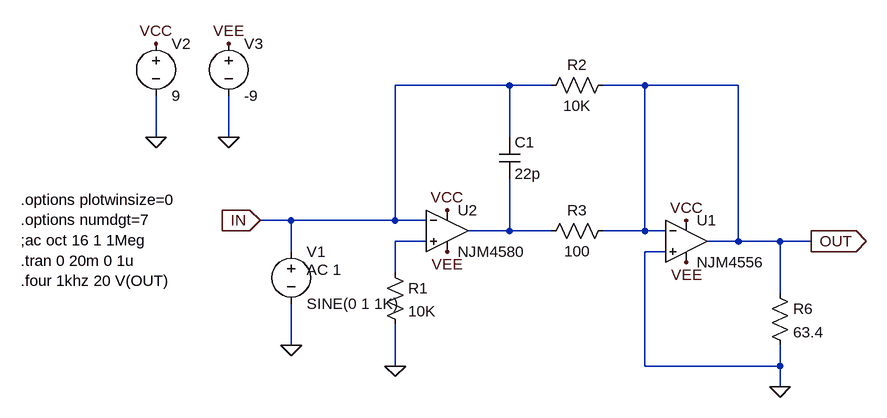
[diagram p0: schematic njm.inv.headphone.amplifier.asc]
njm.inv.headphone.amplifier.asc, the LTspice schematic file:
Version 4
SHEET 1 880 680
WIRE 128 -352 -48 -352
WIRE 192 -352 128 -352
WIRE 336 -352 272 -352
WIRE 480 -352 336 -352
WIRE -416 -272 -416 -336
WIRE -304 -272 -304 -336
WIRE 128 -272 128 -352
WIRE -208 -144 -256 -144
WIRE -48 -144 -48 -352
WIRE -48 -144 -208 -144
WIRE 0 -144 -48 -144
WIRE 128 -128 128 -208
WIRE 128 -128 64 -128
WIRE 192 -128 128 -128
WIRE 336 -128 336 -352
WIRE 336 -128 272 -128
WIRE 368 -128 336 -128
WIRE 0 -112 -48 -112
WIRE 480 -112 480 -352
WIRE 480 -112 432 -112
WIRE 544 -112 480 -112
WIRE 592 -112 544 -112
WIRE -208 -96 -208 -144
WIRE 368 -96 336 -96
WIRE -48 -64 -48 -112
WIRE 544 -32 544 -112
WIRE -208 48 -208 -16
WIRE -48 80 -48 16
WIRE 336 80 336 -96
WIRE 544 80 544 48
WIRE 544 80 336 80
WIRE 544 112 544 80
FLAG 592 -112 OUT
IOPIN 592 -112 Out
FLAG -48 80 0
FLAG 544 112 0
FLAG -208 48 0
FLAG 32 -160 VCC
FLAG 400 -144 VCC
FLAG 32 -96 VEE
FLAG 400 -80 VEE
FLAG -256 -144 IN
IOPIN -256 -144 In
FLAG -416 -416 VCC
FLAG -304 -416 VEE
FLAG -416 -272 0
FLAG -304 -272 0
SYMBOL res -64 -80 R0
SYMATTR InstName R1
SYMATTR Value 10K
SYMATTR SpiceLine tol=1 pwr=0.1
SYMBOL res 288 -368 R90
WINDOW 0 0 56 VBottom 2
WINDOW 3 32 56 VTop 2
SYMATTR InstName R2
SYMATTR Value 10K
SYMATTR SpiceLine tol=1 pwr=0.1
SYMBOL res 288 -144 R90
WINDOW 0 0 56 VBottom 2
WINDOW 3 32 56 VTop 2
SYMATTR InstName R3
SYMATTR Value 100
SYMATTR SpiceLine tol=1 pwr=0.1
SYMBOL res 528 -48 R0
SYMATTR InstName R6
SYMATTR Value 63.4
SYMATTR SpiceLine tol=1 pwr=0.1
SYMBOL voltage -208 -112 R0
WINDOW 123 24 44 Left 2
WINDOW 39 0 0 Left 2
SYMATTR Value2 AC 1
SYMATTR InstName V1
SYMATTR Value SINE(0 1 1K)
SYMBOL voltage -416 -432 R0
WINDOW 123 0 0 Left 2
WINDOW 39 0 0 Left 2
SYMATTR InstName V2
SYMATTR Value 9
SYMBOL voltage -304 -432 R0
WINDOW 123 0 0 Left 2
WINDOW 39 0 0 Left 2
SYMATTR InstName V3
SYMATTR Value -9
SYMBOL cap 112 -272 R0
SYMATTR InstName C1
SYMATTR Value 22p
SYMATTR SpiceLine V=16 Irms=0 Rser=0.304815 Lser=0.302429f mfg="Wuerth Elektronik" pn="885012005027 WCAP-CSGP 0402" type="NP0"
SYMBOL Opamps\\extra_lib\\NJM4556 400 -176 R0
SYMATTR InstName U1
SYMBOL Opamps\\extra_lib\\NJM4580 32 -192 R0
SYMATTR InstName U2
TEXT -624 -176 Left 2 !.options plotwinsize=0\n.options numdgt=7\n;ac oct 16 1 1Meg\n.tran 0 20m 0 1u\n.four 1khz 20 V(OUT)

The netlist it stands for:
* njm.inv.headphone.amplifier.asc
R1 N002 0 10K tol=1 pwr=0.1
R2 OUT IN 10K tol=1 pwr=0.1
R3 OUT N001 100 tol=1 pwr=0.1
R6 OUT 0 63.4 tol=1 pwr=0.1
V1 IN 0 SINE(0 1 1K) AC 1
V2 VCC 0 9
V3 VEE 0 -9
C1 IN N001 22p V=16 Irms=0 Rser=0.304815 Lser=0.302429f mfg="Wuerth Elektronik" pn="885012005027 WCAP-CSGP 0402" type="NP0"
XU1 0 OUT VCC VEE OUT NJM4556  ; pins In+ In- V+ V- OUT
XU2 N002 IN VCC VEE N001 NJM4580  ; pins In+ In- V+ V- OUT
.options plotwinsize=0
.options numdgt=7
;ac oct 16 1 1Meg
.tran 0 20m 0 1u
.four 1khz 20 V(OUT)
.backanno
.end